# Altium schematic sheet DIGITAL_OUTPUT.SchDoc
size A4; SheetNumber: 5; SheetTotal: 16
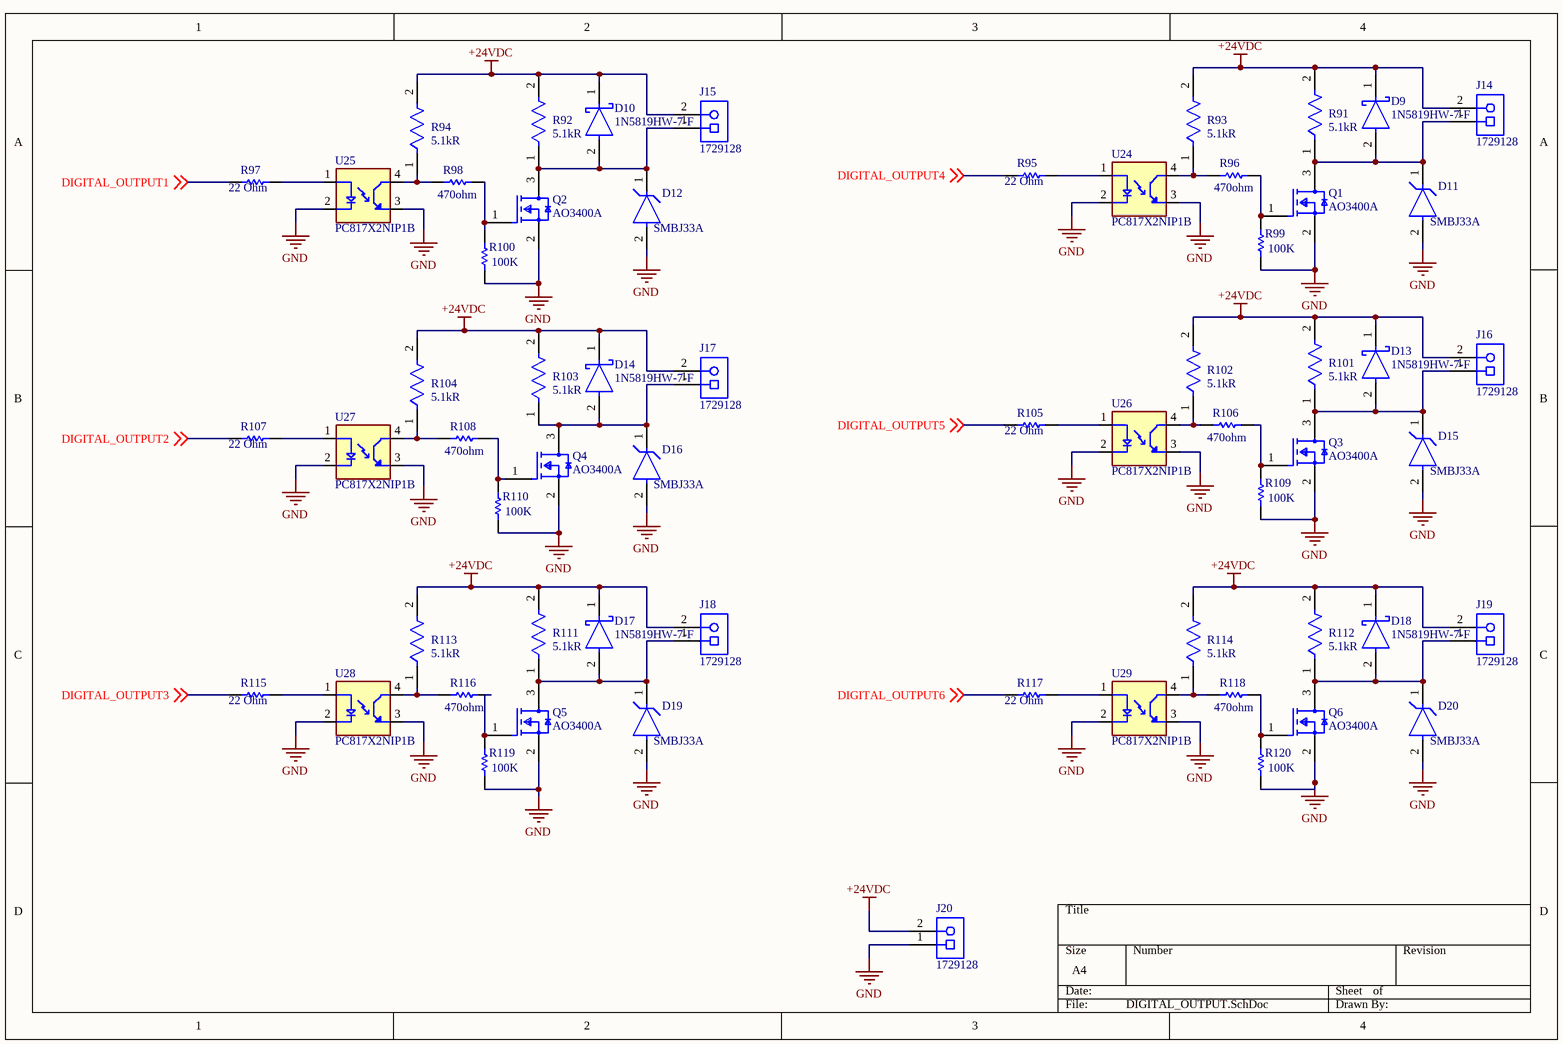
[diagram p0: DIGITAL_OUTPUT.SchDoc]

## Parts
D9  1N5819HW-7-F  [FP-SOD123-IPC_A]
D10  1N5819HW-7-F  [FP-SOD123-IPC_A]
D11  SMBJ33A  [FP-SMBJ-MFG]
D12  SMBJ33A  [FP-SMBJ-MFG]
D13  1N5819HW-7-F  [FP-SOD123-IPC_A]
D14  1N5819HW-7-F  [FP-SOD123-IPC_A]
D15  SMBJ33A  [FP-SMBJ-MFG]
D16  SMBJ33A  [FP-SMBJ-MFG]
D17  1N5819HW-7-F  [FP-SOD123-IPC_A]
D18  1N5819HW-7-F  [FP-SOD123-IPC_A]
D19  SMBJ33A  [FP-SMBJ-MFG]
D20  SMBJ33A  [FP-SMBJ-MFG]
J14  1729128  [PHOE-1729128-2_V]
J15  1729128  [PHOE-1729128-2_V]
J16  1729128  [PHOE-1729128-2_V]
J17  1729128  [PHOE-1729128-2_V]
J18  1729128  [PHOE-1729128-2_V]
J19  1729128  [PHOE-1729128-2_V]
J20  1729128  [PHOE-1729128-2_V]
Q1  AO3400A  [FP-SOT23-MFG]
Q2  AO3400A  [FP-SOT23-MFG]
Q3  AO3400A  [FP-SOT23-MFG]
Q4  AO3400A  [FP-SOT23-MFG]
Q5  AO3400A  [FP-SOT23-MFG]
Q6  AO3400A  [FP-SOT23-MFG]
R91  Resistance: 5.1kR  [FP-CRCW0603-e3-IPC_C]  (hidden comment: CRCW06035K10FKEA)
R92  Resistance: 5.1kR  [FP-CRCW0603-e3-IPC_C]  (hidden comment: CRCW06035K10FKEA)
R93  Resistance: 5.1kR  [FP-CRCW0603-e3-IPC_C]  (hidden comment: CRCW06035K10FKEA)
R94  Resistance: 5.1kR  [FP-CRCW0603-e3-IPC_C]  (hidden comment: CRCW06035K10FKEA)
R95  Resistance: 22 Ohm  [RESC1608X55X30LL15T15]  (hidden comment: ERJ-3EKF2200V)
R96  Resistance: 470ohm  [RESC2013X60X35LL10T20]  (hidden comment: RC0805FR-07470RL)
R97  Resistance: 22 Ohm  [RESC1608X55X30LL15T15]  (hidden comment: ERJ-3EKF2200V)
R98  Resistance: 470ohm  [RESC2013X60X35LL10T20]  (hidden comment: RC0805FR-07470RL)
R99  value 100K  [RESC2013X50X30ML20T20]  (hidden comment: CRCW0805100KJNEA)
R100  value 100K  [RESC2013X50X30ML20T20]  (hidden comment: CRCW0805100KJNEA)
R101  Resistance: 5.1kR  [FP-CRCW0603-e3-IPC_C]  (hidden comment: CRCW06035K10FKEA)
R102  Resistance: 5.1kR  [FP-CRCW0603-e3-IPC_C]  (hidden comment: CRCW06035K10FKEA)
R103  Resistance: 5.1kR  [FP-CRCW0603-e3-IPC_C]  (hidden comment: CRCW06035K10FKEA)
R104  Resistance: 5.1kR  [FP-CRCW0603-e3-IPC_C]  (hidden comment: CRCW06035K10FKEA)
R105  Resistance: 22 Ohm  [RESC1608X55X30LL15T15]  (hidden comment: ERJ-3EKF2200V)
R106  Resistance: 470ohm  [RESC2013X60X35LL10T20]  (hidden comment: RC0805FR-07470RL)
R107  Resistance: 22 Ohm  [RESC1608X55X30LL15T15]  (hidden comment: ERJ-3EKF2200V)
R108  Resistance: 470ohm  [RESC2013X60X35LL10T20]  (hidden comment: RC0805FR-07470RL)
R109  value 100K  [RESC2013X50X30ML20T20]  (hidden comment: CRCW0805100KJNEA)
R110  value 100K  [RESC2013X50X30ML20T20]  (hidden comment: CRCW0805100KJNEA)
R111  Resistance: 5.1kR  [FP-CRCW0603-e3-IPC_C]  (hidden comment: CRCW06035K10FKEA)
R112  Resistance: 5.1kR  [FP-CRCW0603-e3-IPC_C]  (hidden comment: CRCW06035K10FKEA)
R113  Resistance: 5.1kR  [FP-CRCW0603-e3-IPC_C]  (hidden comment: CRCW06035K10FKEA)
R114  Resistance: 5.1kR  [FP-CRCW0603-e3-IPC_C]  (hidden comment: CRCW06035K10FKEA)
R115  Resistance: 22 Ohm  [RESC1608X55X30LL15T15]  (hidden comment: ERJ-3EKF2200V)
R116  Resistance: 470ohm  [RESC2013X60X35LL10T20]  (hidden comment: RC0805FR-07470RL)
R117  Resistance: 22 Ohm  [RESC1608X55X30LL15T15]  (hidden comment: ERJ-3EKF2200V)
R118  Resistance: 470ohm  [RESC2013X60X35LL10T20]  (hidden comment: RC0805FR-07470RL)
R119  value 100K  [RESC2013X50X30ML20T20]  (hidden comment: CRCW0805100KJNEA)
R120  value 100K  [RESC2013X50X30ML20T20]  (hidden comment: CRCW0805100KJNEA)
U24  PC817X2NIP1B  [SOIC254P960X420-4N]
U25  PC817X2NIP1B  [SOIC254P960X420-4N]
U26  PC817X2NIP1B  [SOIC254P960X420-4N]
U27  PC817X2NIP1B  [SOIC254P960X420-4N]
U28  PC817X2NIP1B  [SOIC254P960X420-4N]
U29  PC817X2NIP1B  [SOIC254P960X420-4N]

## Nets
+24VDC: D9.1(C) D10.1(C) D13.1(C) D14.1(C) D17.1(C) D18.1(C) J14.2 J15.2 J16.2 J17.2 J18.2 J19.2 J20.2 R91.2 R92.2 R93.2 R94.2 R101.2 R102.2 R103.2 R104.2 R111.2 R112.2 R113.2 R114.2
GND: D11.2(A) D12.2(A) D15.2(A) D16.2(A) D19.2(A) D20.2(A) J20.1 Q1.2(S) Q2.2(S) Q3.2(S) Q4.2(S) Q5.2(S) Q6.2(S) R99.1 R100.1 R109.1 R110.1 R119.1 R120.1 U24.2(C) U24.3(ET) U25.2(C) U25.3(ET) U26.2(C) U26.3(ET) U27.2(C) U27.3(ET) U28.2(C) U28.3(ET) U29.2(C) U29.3(ET)
DIGITAL_OUTPUT1: R97.1 ; off-sheet DIGITAL_OUTPUT1
DIGITAL_OUTPUT2: R107.1 ; off-sheet DIGITAL_OUTPUT2
DIGITAL_OUTPUT3: R115.1 ; off-sheet DIGITAL_OUTPUT3
DIGITAL_OUTPUT4: R95.1 ; off-sheet DIGITAL_OUTPUT4
DIGITAL_OUTPUT5: R105.1 ; off-sheet DIGITAL_OUTPUT5
DIGITAL_OUTPUT6: R117.1 ; off-sheet DIGITAL_OUTPUT6
NetD9_2: D9.2(A) D11.1(C) J14.1 Q1.3(D) R91.1
NetD10_2: D10.2(A) D12.1(C) J15.1 Q2.3(D) R92.1
NetD13_2: D13.2(A) D15.1(C) J16.1 Q3.3(D) R101.1
NetD14_2: D14.2(A) D16.1(C) J17.1 Q4.3(D) R103.1
NetD17_2: D17.2(A) D19.1(C) J18.1 Q5.3(D) R111.1
NetD18_2: D18.2(A) D20.1(C) J19.1 Q6.3(D) R112.1
NetQ1_1: Q1.1(G) R96.2 R99.2
NetQ2_1: Q2.1(G) R98.2 R100.2
NetQ3_1: Q3.1(G) R106.2 R109.2
NetQ4_1: Q4.1(G) R108.2 R110.2
NetQ5_1: Q5.1(G) R116.2 R119.2
NetQ6_1: Q6.1(G) R118.2 R120.2
NetR93_1: R93.1 R96.1 U24.4(CT)
NetR94_1: R94.1 R98.1 U25.4(CT)
NetR95_2: R95.2 U24.1(A)
NetR97_2: R97.2 U25.1(A)
NetR102_1: R102.1 R106.1 U26.4(CT)
NetR104_1: R104.1 R108.1 U27.4(CT)
NetR105_2: R105.2 U26.1(A)
NetR107_2: R107.2 U27.1(A)
NetR113_1: R113.1 R116.1 U28.4(CT)
NetR114_1: R114.1 R118.1 U29.4(CT)
NetR115_2: R115.2 U28.1(A)
NetR117_2: R117.2 U29.1(A)

## Library data of the parts
D9 D10 D13 D14 D17 D18 = CMP-0303-00003-3: DIODE SCHOTTKY 40V 1A SOD123; Forward Voltage: 450mV; Capacitance: 110pF; Max Forward Surge Current (Ifsm): 25A; Peak Reverse Current: 50uA; Polarity: Standard; Element Configuration: Single; Max Power Dissipation: 450mW; Min Operating Temperature: -65°C; Package Quantity: 3000; Contact Plating: Tin; Weight: 0.000353oz; Max Repetitive Reverse Voltage (Vrrm): 40V; Max Reverse Voltage (DC): 40V; Height: 1.25mm; Average Rectified Current: 1A; Width: 1.7mm; Case/Package: SOD-123-2; Lead Free: Lead Free; Max Operating Temperature: 125°C; Current Rating: 1A; Termination: SMD/SMT; Forward Current: 1A; Radiation Hardening: No; Number of Pins: 2; Length: 2.85mm; Voltage Rating (DC): 40V; REACH SVHC: No SVHC; Peak Non-Repetitive Surge Current: 25A; Packaging: Tape and Reel; Output Current: 1A
D11 D12 D15 D16 D19 D20 = CMP-2000-07095-2: TVS DIODE 33V 53.3V DO214AA; Manufacturer: Littelfuse Inc; Max Junction Temp: +150°C; Number Of Channels: 1; Breakdown Voltage: 36.7V; Peak Pulse Power: 600W; Direction: Unidirectional; Peak Pulse Current: 11.3A; Lead Free: Yes; Height: 2.61mm; Temperature Range Low: -65°C; ComponentLink2URL: https://www.littelfuse.com/~/media/electronics/datasheets/tvs_diodes/littelfuse_tvs_diode_smbj_datasheet.pdf.pdf; Manufacturer Part Number: SMBJ33A; Clamping Voltage: 53.3V; Device Class L1: Circuit Protection; Octopart: https://octopart.com/smbj33a-littelfuse-350829; Device Class L2: TVS Diodes; Digikey Description: TVS DIODE 33V 53.3V DO214AA; Automotive: No; Temperature Range High: +150°C; Package: SMBJ; ComponentLink2Description: Datasheet; Mouser Description: TVS DIODE 33V 53.3V DO214AA; Reverse Standoff Voltage: 33V; Category: Diode; Device Class L3: unset; Temperature: -65°C to +150°C; RoHS: TRUE
J14-J20 = CMP-2000-05815-1: PCB Terminal Block, 13.5 A, 400 V, 2-Pin THD, RoHS, Bulk; Manufacturer: Phoenix Contact; Package Version: 03/2015; No. of Rows: 1; Pitch: 5.08mm; No. of Positions: 2; Voltage Rating: 400V; Current Rating: 13500mA; Manufacturer URL: http://www.phoenixcontact.com/; Datasheet URL: https://datasheet.ciiva.com/16046/1729128-16046181.pdf; RoHS: TRUE; Package URL: https://www.phoenixcontact.com/online/portal/pi/pxc/product_detail_page/!ut/p/b1/3VdJjqNKFDxLH8AFycySyWY2ozFsEPOMMQaDOX1XedGL_1Vdm5YXJleknhSKeBkvI6EA8ncAo3AYoDhBQGco6KN7VURTdemj9us_IEKEZo_YHiPAEWEFmDGOHMORkqKYCORBZxgL7ZoaZYcbFFUZ3fqxSY6GOuxydWUuHqz1ynmMFygu583Bob0Ewr6Sd_l-5m-kAueHiB0jpRwZwe58wwtkpxtMYd_LmGcDRU02dRNEyWt6Y2ti5pSyJ_reIkzIulrqApdnbT11V5jnCKbYNCvhEM1MCpPByat_X379-iThf08CI5GfOPqfBeS3BRoBOdD55AKVv0iLwCMq-2BrzXWSGRH7pUGD9uwXQjiph3xL0DKQwdGa0JImiIOmBNOestqgwTHSSs2oOep-78apyXQBvNi8ZLaFjvjWvcaUEBu0MC6Wbe-d6mB0FAebo2lUWinqYaZs5DAYzV0RP9yitUjnGJ0iI9xhZkT42OCQNUJJhkgWINNQLP2JFP6OpMg3JCVg70jqHT0lvKOnhHf0lPuOnnLf0VPuWx6_dxwUIvwk5WMkT0kLL1mh61l2yZVSzG3pYV_bqo-mj6uMKwKwdnnW8Jh5RTOJzMOA5c-eJDaZQw4mTMPH02PvS_ZAqNVjVTo2WyYLkwH_KU1mmmG5kjRhDqPXLwwVHvVOjCM60-fpXvTDfMGW1PVFVS1r4e4yVDk4ZdNbkUHvqPqQSeian4UD39fNKmachqdJ1NJbyk8rXT9mXTvPk3oE5meulKGgiruPJek-4I9hTT6G8ZLOyRSm2RRVbThERQad5OS28hdt4YW4vG0stgYYzsWsK4_7y6DZMjJSCqri1kyiZR5vD7pwIrNR7QwPHTcLTI5qT7eRlpHrdGiupYlqQDJ7zy_CND8fWWBoLRXxk1RVcXiBQwbTD4Xi7KL-FuO94t9xaqweXzH; PartNumber: 1729128; Package Description: 2-Pin Through Hole Device, Body 8.1 x 10.16 mm, Pitch 5.08 mm; Datasheet Version: 12/2013; Mounting Technology: ThroughHole; Orientation: Horizontal; Package Reference: 1729128-2; Packing: Bulk
Q1-Q6 = CMP-83955-000006-1: MOSFET N-CH 30V 5.7A SOT23; Input Capacitance: 630pF; Number of Elements: 1; Rds On Max: 26.5mR; Max Power Dissipation: 1.4W; Gate to Source Voltage (Vgs): 12V; Min Operating Temperature: -55°C; Lead Free: Lead Free; Number of Pins: 3; Drain to Source Voltage (Vdss): 30V; Case/Package: SOT-23; Mount: Surface Mount; Continuous Drain Current (ID): 5.7A; Radiation Hardening: No; Packaging: Tape and Reel; Max Operating Temperature: 150°C; Power Dissipation: 1.4W
R91-R94 R101-R104 R111-R114 = CMP-1012-00590-3: RES Thick Film, 5.1kΩ, 1%, 0.1W, 100ppm/°C, 0603; Power Rating: 100mW; Voltage Rating (DC): 75V; Width: 0.85mm; Depth: 0.85mm; Military Standard: Not; Package Quantity: 5000; Case Code (Metric): 1608; Length: 1.55mm; Weight: 7.1E-05oz; Packaging: Tape and Reel; Temperature Coefficient: 100ppm/°C; Case Code (Imperial): 0603; Lead Free: Lead Free; Radiation Hardening: No; Contact Plating: Tin; Composition: Thick Film; Max Operating Temperature: 155°C; Termination: SMD/SMT; Case/Package: 0603; Min Operating Temperature: -55°C; Tolerance: 1%; Voltage Rating: 75V; Mount: Surface Mount; Height: 0.45mm
R95 R97 R105 R107 R115 R117 = CMP-2000-00335-2: Chip Resistor, 220 Ohm, +/- 1%, 0.1 W, -55 to 155 degC, 0603 (1608 Metric), RoHS, Tape and Reel; Voltage Rating: 50 V; Power Rating: 100 mW; Case\Package: 0603; ComponentLink2Description: Datasheet; PackageDescription: 2-Pin Surface Mount Device, Body 1.6 x 0.85 mm; PackageReference: 0603; ComponentLink1Description: Manufacturer URL; ComponentLink2URL: http://industrial.panasonic.com/cdbs/www-data/pdf/RDA0000/AOA0000C86.pdf; Height: 0.45 mm; Mount: Surface Mount; Case Code (Metric): 1608; Pins: 2; Width: 0.8 mm; Length: 1.6 mm; Package Quantity: 5000; Tolerance: 1%; ComponentLink1URL: http://www.panasonic.com/; Max Operating Temperature: 155 degC; Min Operating Temperature: -55 degC; RoHSCompliant: true; Packaging: Tape and Reel; Case Code (Imperial): 0603; DatasheetVersion: Apr-15; REACH SVHC: No SVHC; Voltage Rating (DC): 50 V
R96 R98 R106 R108 R116 R118 = CMP-2000-06961-1: Chip Resistor, 470 Ohm, +/- 1%, 125 mW, -55 to 155 degC, 0805 (2012 Metric), RoHS, Tape and Reel; Manufacturer: Yageo; Power Rating: 250mW; Resistor Case Style: 0805[2012Metric]; Voltage Rating: 150V; Resistor Element Type: ThickFilm; Temperature Coefficient: ±100ppm/°C; SVHC: ToBeAdvised; Datasheet Version: Rev. 7, 05/2017; Automotive Qualification Standard: -; Mounting Technology: SurfaceMount; Product Range: -; Packaging: Tape&Reel; Package Description: 2-Pin Surface Mounted Device, Body 2 x 1.25 mm; MSL: MSL1-Unlimited; Package Reference: 0805; Resistance Tolerance: ±1%; Datasheet URL: http://www.yageo.com/documents/recent/PYu-RC_Group_51_RoHS_L_7.pdf; Manufacturer URL: http://www.yageo.com/
R99 R100 R109 R110 R119 R120 = CMP-2001-04900-1: Manufacturer: Vishay Dale; Part Number: CRCW0805100KJNEA
U24-U29 = PC817X2NIP1B: Optocoupler DC-IN 1-CH Transistor DC-OUT 4-Pin DIP SMD T/R; MF: Sharp Microelectronics; SnapEDA_Link: https://www.snapeda.com/parts/PC817X2NIP1B/Sharp+Microelectronics/view-part/?ref=snap; Package: SMD-4 Sharp Microelectronics; Value: *; MP: PC817X2NIP1B; Check_prices: https://www.snapeda.com/parts/PC817X2NIP1B/Sharp+Microelectronics/view-part/?ref=eda